# EAGLE design EnvironmentMonitorV6.1 (EAGLE 7.4.0)

## Sheet 1 of 2
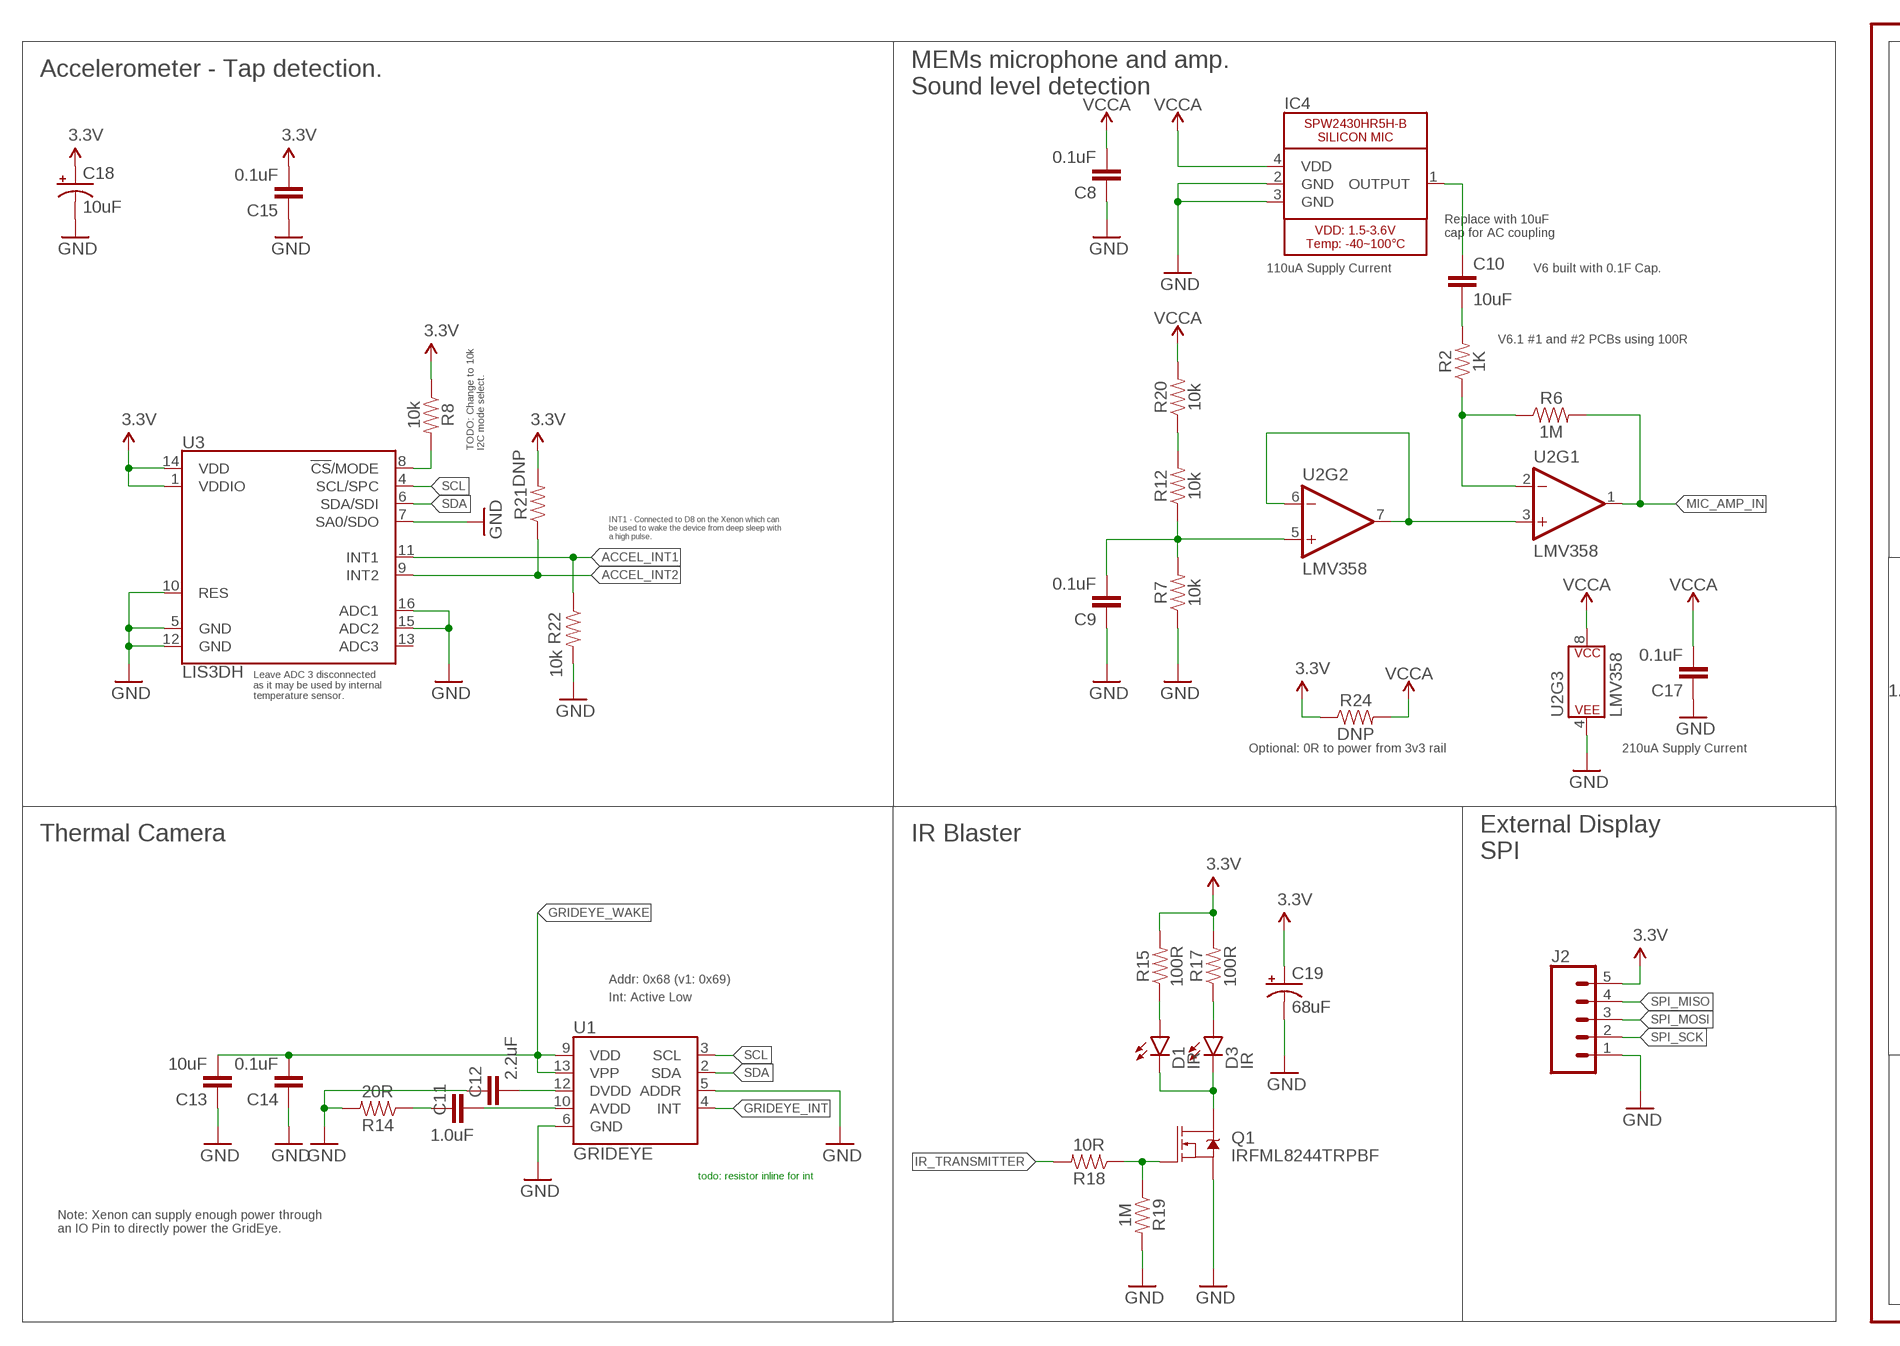
[diagram p0: schematic, sheet 1, part 1 of 2]
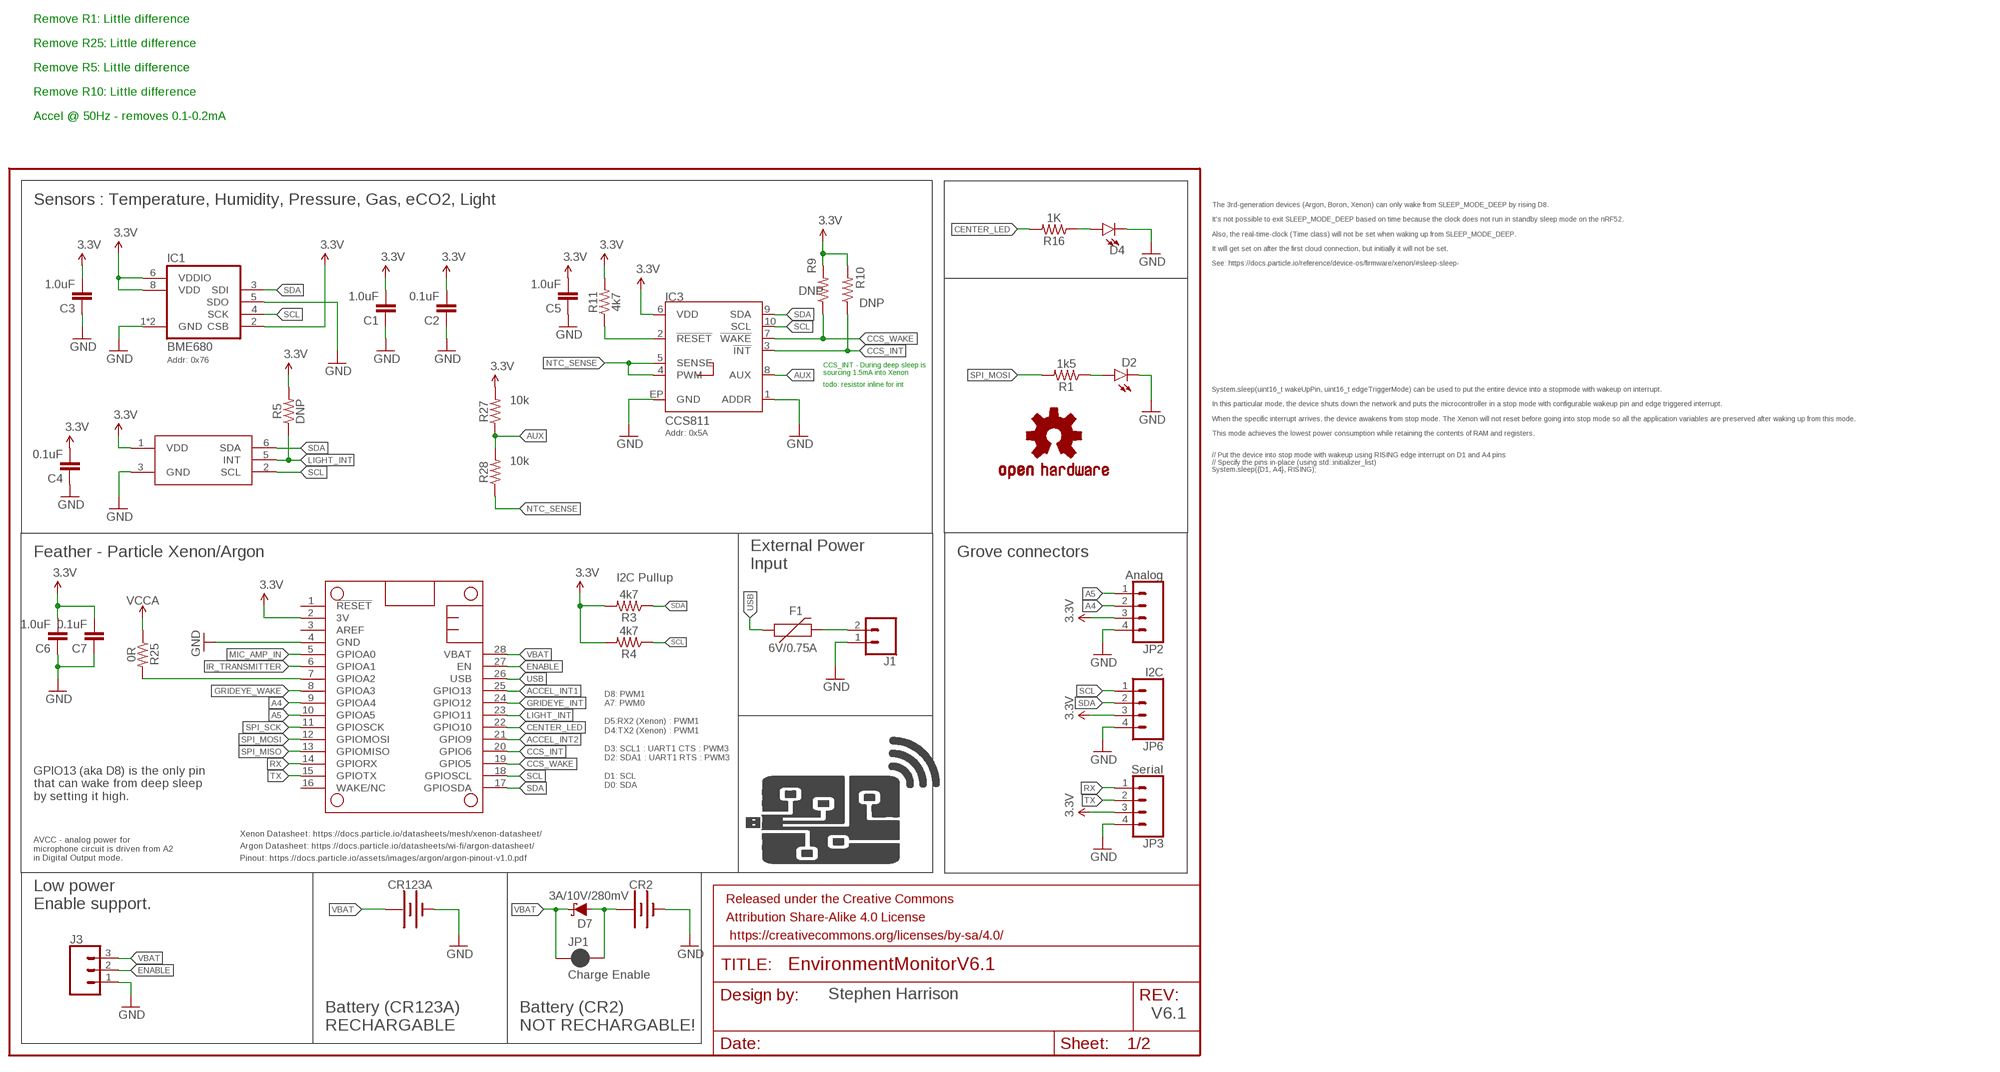
[diagram p1: schematic, sheet 1, part 2 of 2]

### Parts
C1  1.0uF  1.0UF-25V-+80/-20(0805)"  [0805-CAP]
C2  0.1uF  1.0UF-25V-+80/-20(0805)"  [0805-CAP]
C3  1.0uF  1.0UF-25V-+80/-20(0805)"  [0805-CAP]
C4  0.1uF  1.0UF-25V-+80/-20(0805)"  [0805-CAP]
C5  1.0uF  1.0UF-25V-+80/-20(0805)"  [0805-CAP]
C6  1.0uF  1.0UF-25V-+80/-20(0805)"  [0805-CAP]
C7  0.1uF  1.0UF-25V-+80/-20(0805)"  [0805-CAP]
C8  0.1uF  1.0UF-25V-+80/-20(0805)"  [0805-CAP]
C9  0.1uF  1.0UF-25V-+80/-20(0805)"  [0805-CAP]
C10  10uF  1.0UF-25V-+80/-20(0805)"  [0805-CAP]
C11  1.0uF  1.0UF-25V-+80/-20(0805)"  [0805-CAP]
C12  2.2uF  1.0UF-25V-+80/-20(0805)"  [0805-CAP]
C13  10uF  1.0UF-25V-+80/-20(0805)"  [0805-CAP]
C14  0.1uF  1.0UF-25V-+80/-20(0805)"  [0805-CAP]
C15  0.1uF  1.0UF-25V-+80/-20(0805)"  [0805-CAP]
C17  0.1uF  1.0UF-25V-+80/-20(0805)"  [0805-CAP]
C18  10uF  10UF-POLAR-EIA3216-16V-10%(TANT)  [EIA3216]
C19  68uF  68UF-POLAR-EIA3528-10V-10%(TANT)  [EIA3528]
CR2  BATTERYCR2-NO-HOLES  [BATTERY_CR2-HOLDER-NO-HOLES]
CR123A  BATTERY-16340  [BATTERY_16340-HOLDER]
D1  IR  LED1206  [LED-1206]
D2  LED1206-BOTTOM  [LED-1206-BOTTOM]
D3  IR  LED1206  [LED-1206]
D4  LED1206  [LED-1206]
D7  3A/10V/280mV  DIODE-SCHOTTKY-BAT60A  [SOD-323]
F1  6V/0.75A  PPTC_THREE-QUARTER-AMP  [1206]
FRAME1  FRAME-LETTER  [CREATIVE_COMMONS]
IC1  BME680  [BME680]
IC2  TCS3472  [FN-6]
IC3  CCS811  [LGA10]
IC4  SPW2430HR5H-B  [SPW2430HR5H-B]
IC5  FEATHERWINGPADS_AND_PLACE_ONLY  [FEATHERWIND_PADS_AND_PLACE]
J1  CONN_02JST-2-PH-SIDE  [JST-2-SMD]
J2  CONN_05SMD2  [1X05_1MM_RA]
J3  CONN_03SMD  [1X03-1MM-RA]
JP1  Charge Enable  JUMPER-SMT_2_NC_PASTE_SILK  [SMT-JUMPER_2_NC_PASTE_SILK]
JP2  Analog  CONN_04GROVE-JST-PH-4-2MM  [JST-4-PH-GROVE]
JP3  Serial  CONN_04GROVE-JST-PH-4-2MM  [JST-4-PH-GROVE]
JP6  I2C  CONN_04GROVE-JST-PH-4-2MM  [JST-4-PH-GROVE]
LOGO1  OSHW-LOGOM  [OSHW-LOGO-M]
Q1  IRFML8244TRPBF  MOSFET-NCH-BSS138  [SOT23-3]
R1  1k5  RESISTOR0805  [0805]
R2  1K  RESISTOR0805  [0805]
R3  4k7  RESISTOR0805  [0805]
R4  4k7  RESISTOR0805  [0805]
R5  DNP  RESISTOR0805  [0805]
R6  1M  RESISTOR0805  [0805]
R7  10k  RESISTOR0805  [0805]
R8  10k  RESISTOR0805  [0805]
R9  DNP  RESISTOR0805  [0805]
R10  DNP  RESISTOR0805  [0805]
R11  4k7  RESISTOR0805  [0805]
R12  10k  RESISTOR0805  [0805]
R14  20R  RESISTOR0805  [0805]
R15  100R  RESISTOR0805  [0805]
R16  1K  RESISTOR0805  [0805]
R17  100R  RESISTOR0805  [0805]
R18  10R  RESISTOR0805  [0805]
R19  1M  RESISTOR0805  [0805]
R20  10k  RESISTOR0805  [0805]
R21  DNP  RESISTOR0805  [0805]
R22  10k  RESISTOR0805  [0805]
R24  DNP  RESISTOR0805  [0805]
R25  0R  RESISTOR0805  [0805]
R27  10k  RESISTOR0805  [0805]
R28  10k  RESISTOR0805  [0805]
U1  GRIDEYE  [GRIDEYE-AMG88]
U2  LMV358  LMV358SOIC  [SO08]
U3  LIS3DH  [LGA-16-3X3]
U$1  THINGYSTICKS_LOGOLOGO_2  [THINGYSTICKS_LOGO_2]

### Nets
3.3V: C1.2 C2.2 C3.2 C4.2 C5.2 C6.2 C7.2 C15.2 C18.+ C19.A(+) IC1.2(CSB) IC1.6(VDDIO) IC1.8(VDD) IC2.1(VDD) IC3.6(VDD) IC5.2(3V) J2.5 JP2.3 JP3.3 JP6.3 R3.2 R4.2 R5.2 R8.1 R9.2 R10.2 R11.2 R15.2 R17.2 R21.2 R24.1 R27.2 U3.1(VDDIO) U3.14(VDD)
A4: IC5.9(GPIOA4) JP2.2
A5: IC5.10(GPIOA5) JP2.1
ACCEL_INT1: IC5.25(GPIO13) R22.1 U3.11(INT1)
ACCEL_INT2: IC5.21(GPIO9) R21.1 U3.9(INT2)
AUX: IC3.8(AUX) R27.1 R28.2
CCS8_RESET: IC3.2(!RESET!) R11.1
CCS_INT: IC3.3(!INT!) IC5.20(GPIO6) R10.1
CCS_WAKE: IC3.7(!WAKE!) IC5.19(GPIO5) R9.1
CENTER_LED: IC5.22(GPIO10) R16.2
ENABLE: IC5.27(EN) J3.2
GND: C1.1 C2.1 C3.1 C4.1 C5.1 C6.1 C7.1 C8.1 C9.1 C12.1 C13.1 C14.1 C15.1 C17.1 C18.- C19.C(-) CR2.P$2(-) CR123A.P$2(-) D2.C D4.C IC1.1(GND) IC1.5(SDO) IC1.7(GND) IC2.3(GND) IC3.1(ADDR) IC3.EP(GND) IC4.2(GND) IC4.3(GND) IC5.4(GND) J1.1 J2.1 J3.1 JP2.4 JP3.4 JP6.4 Q1.2(S) R7.1 R14.2 R19.2 R22.2 U1.5(ADDR) U1.6(GND) U2.4(P$V-) U3.5(GND) U3.7(SA0/SDO) U3.10(RES) U3.12(GND) U3.15(ADC2) U3.16(ADC1)
GRIDEYE_INT: IC5.24(GPIO12) U1.4(INT)
GRIDEYE_WAKE: C13.2 C14.2 IC5.8(GPIOA3) U1.9(VDD) U1.13(VPP)
IR_TRANSMITTER: IC5.6(GPIOA1) R18.2
LIGHT_INT: IC2.5(INT) IC5.23(GPIO11) R5.1
MIC_AMP_IN: IC5.5(GPIOA0) R6.2 U2.1(OUT)
N$1: R2.1 R6.1 U2.2(-IN)
N$2: D1.A R15.1
N$4: C10.2 R2.2
N$5: U2.3(+IN) U2.6(-IN) U2.7(OUT)
N$6: D2.A R1.1
N$7: C10.1 IC4.1(OUTPUT)
N$8: D3.A R17.1
N$9: C9.2 R7.2 R12.1 U2.5(+IN)
N$11: D1.C D3.C Q1.3(D)
N$12: R12.2 R20.1
N$13: IC5.7(GPIOA2) R25.2
N$14: C12.2 U1.12(DVDD)
N$15: C11.2 U1.10(AVDD)
N$16: C11.1 R14.1
N$17: CR2.P$1(+) D7.A JP1.2
N$18: Q1.1(G) R18.1 R19.1
N$19: F1.2 J1.2
N$20: D4.A R16.1
N$25: R8.2 U3.8(!CS!/MODE)
NTC_SENSE: IC3.4(PWM) IC3.5(SENSE) R28.1
RX: IC5.14(GPIORX) JP3.1
SCL: IC1.4(SCK) IC2.2(SCL) IC3.10(SCL) IC5.18(GPIOSCL) JP6.1 R4.1 U1.3(SCL) U3.4(SCL/SPC)
SDA: IC1.3(SDI) IC2.6(SDA) IC3.9(SDA) IC5.17(GPIOSDA) JP6.2 R3.1 U1.2(SDA) U3.6(SDA/SDI)
SPI_MISO: IC5.13(GPIOMISO) J2.4
SPI_MOSI: IC5.12(GPIOMOSI) J2.3 R1.2
SPI_SCK: IC5.11(GPIOSCK) J2.2
TX: IC5.15(GPIOTX) JP3.2
USB: F1.1 IC5.26(USB)
VBAT: CR123A.P$1(+) D7.C IC5.28(VBAT) J3.3 JP1.1
VCCA: C8.2 C17.2 IC4.4(VDD) R20.2 R24.2 R25.1 U2.8(P$V+)
Unconnected: IC5.1(!RESET) IC5.3(AREF) IC5.16(WAKE/NC) U3.13(ADC3)

### Notes on the sheet
- Remove R1: Little difference
- Remove R25: Little difference
- Remove R5: Little difference
- Remove R10: Little difference
- Accel @ 50Hz - removes 0.1-0.2mA
- Accelerometer - Tap detection. | Sensors : Temperature, Humidity, Pressure, Gas, eCO2, Light
- MEMs microphone and amp.
  Sound level detection
- The 3rd-generation devices (Argon, Boron, Xenon) can only wake from SLEEP_MODE_DEEP by rising D8. 
  
  It's not possible to exit SLEEP_MODE_DEEP based on time because the clock does not run in standby sleep mode on the nRF52.
  
  Also, the real-time-clock (Time class) will not be set when waking up from SLEEP_MODE_DEEP.
  
  It will get set on after the first cloud connection, but initially it will not be set.
  
  See: https://docs.particle.io/reference/device-os/firmware/xenon/#sleep-sleep-
- Replace with 10uF 
  cap for AC coupling
- 110uA Supply Current | V6 built with 0.1F Cap.
- Addr: 0x76
- CCS_INT - During deep sleep is
  sourcing 1.5mA into Xenon
- V6.1 #1 and #2 PCBs using 100R | todo: resistor inline for int
- Addr: 0x5A
- System.sleep(uint16_t wakeUpPin, uint16_t edgeTriggerMode) can be used to put the entire device into a stopmode with wakeup on interrupt. 
  
  In this particular mode, the device shuts down the network and puts the microcontroller in a stop mode with configurable wakeup pin and edge triggered interrupt. 
  
  When the specific interrupt arrives, the device awakens from stop mode. The Xenon will not reset before going into stop mode so all the application variables are preserved after waking up from this mode. 
  
  This mode achieves the lowest power consumption while retaining the contents of RAM and registers.
- TODO: Change to 10k
  I2C mode select.
- // Put the device into stop mode with wakeup using RISING edge interrupt on D1 and A4 pins
  // Specify the pins in-place (using std::initializer_list)
  System.sleep({D1, A4}, RISING);
- INT1 - Connected to D8 on the Xenon which can
  be used to wake the device from deep sleep with
  a high pulse.
- Feather - Particle Xenon/Argon | Grove connectors
- External Power 
  Input
- I2C Pullup
- Leave ADC 3 disconnected
  as it may be used by internal
  temperature sensor.
- Optional: 0R to power from 3v3 rail | 210uA Supply Current
- Thermal Camera | IR Blaster
- External Display
  SPI
- D8: PWM1
  A7: PWM0
  
  D5:RX2 (Xenon) : PWM1
  D4:TX2 (Xenon) : PWM1
  
  D3: SCL1 : UART1 CTS : PWM3
  D2: SDA1 : UART1 RTS : PWM3
  
  D1: SCL
  D0: SDA
- GPIO13 (aka D8) is the only pin
  that can wake from deep sleep 
  by setting it high.
- Addr: 0x68 (v1: 0x69)
- Int: Active Low | Xenon Datasheet: https://docs.particle.io/datasheets/mesh/xenon-datasheet/
- Argon Datasheet: https://docs.particle.io/datasheets/wi-fi/argon-datasheet/
- AVCC - analog power for 
  microphone circuit is driven from A2
  in Digital Output mode.
- Pinout: https://docs.particle.io/assets/images/argon/argon-pinout-v1.0.pdf
- Low power
  Enable support.
- todo: resistor inline for int
- Note: Xenon can supply enough power through
  an IO Pin to directly power the GridEye.
- Stephen Harrison
- V6.1
- Battery (CR123A)
  RECHARGABLE
- Battery (CR2)
  NOT RECHARGABLE!

## Sheet 2 of 2
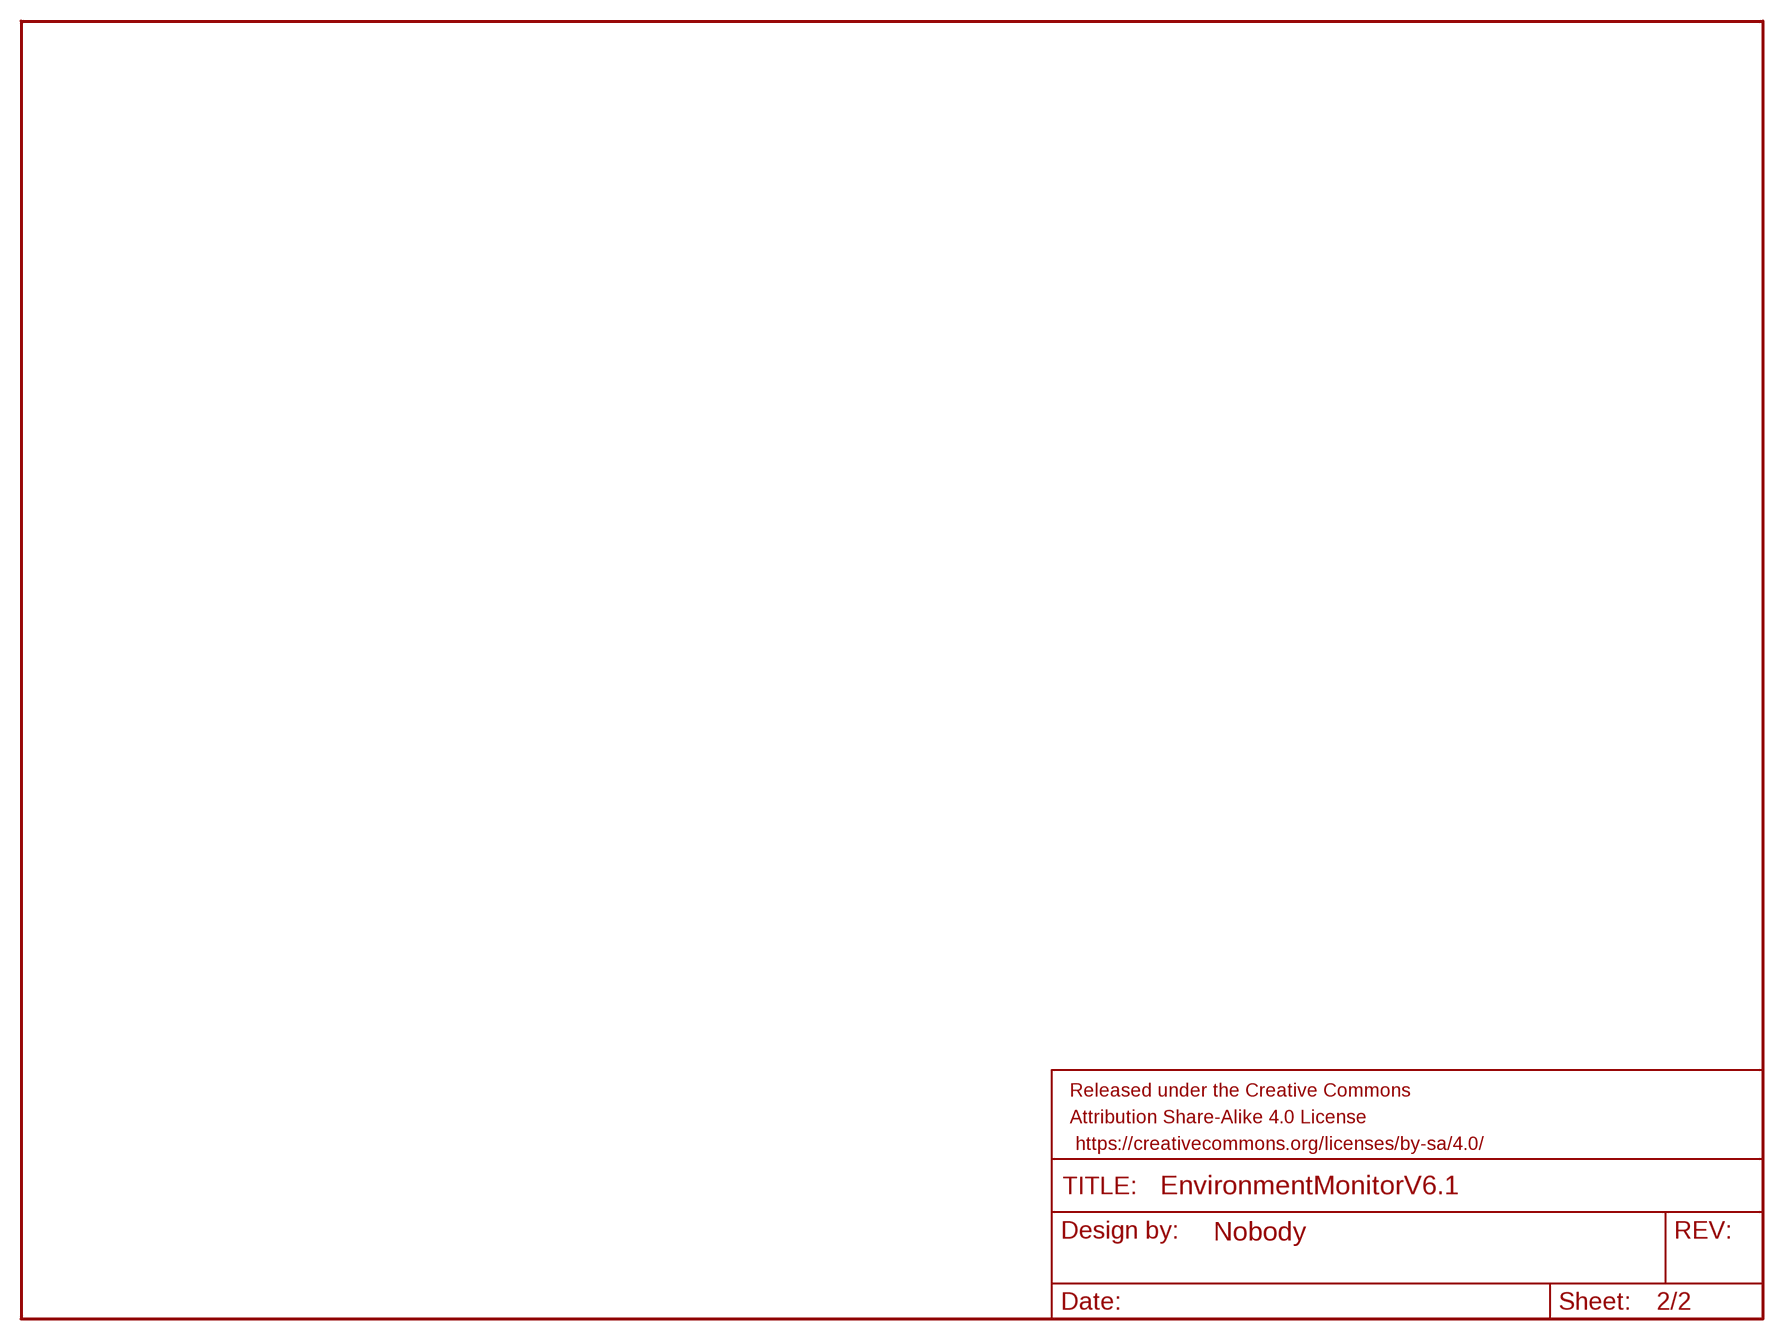
[diagram p2: schematic, sheet 2]

### Parts
FRAME2  FRAME-LETTERNO_PACKAGE  [DUMMY]

## Library data of the parts
C1 C3 C5 C6 C11 = SparkFun-Capacitors:1.0UF-25V-+80/-20(0805): CAP-11625; PROD_ID: CAP-11625
C2 C4 C7-C10 C13-C15 C17 = SparkFun-Capacitors:1.0UF-25V-+80/-20(0805): CAP-11625; PROD_ID: CAP-11625; VALUE: 1.0uF
C12 = SparkFun-Capacitors:1.0UF-25V-+80/-20(0805): CAP-11625; FARNELL: 2070473; PROD_ID: CAP-11625; VALUE: 1.0uF
C18 = SparkFun-Capacitors:10UF-POLAR: 10.0µF polarized capacitors A capacitor is a passive two-terminal electrical component used to store electrical energy temporarily in an electric field.; FARNELL: 1457413; MFG: T491A106K010AT; PROD_ID: CAP-00811
C19 = SparkFun-Capacitors:68UF-POLAR: 68µF polarized capacitors A capacitor is a passive two-terminal electrical component used to store electrical energy temporarily in an electric field.; PROD_ID: CAP-10790
CR2 CR123A = ThingySticks:BATTERY: Battery - Single Cell A variety of battery chemistries, sizes, and footprints. Device List: 20MM_PTH - Coin Cell Battery Holder - 20mm (PTH) <https://www.sparkfun.com/products/783> 12MM_SMD - Coin Cell Battery Holder - 12mm (SMD) <https://www.sparkfun.com/products/10592> 12MM_PTH - Coin Cell Battery Holder - 12mm (PTH) <https://www.sparkfun.com/products/7948> 20MM_SMD - 20mm Coin Cell Battery Holder (SMD) (2 legs) Used on the Big Time Watch Kit <https://www.sparkfun.com/products/11734> 20MM_SMD_4LEGS - Coin Cell Battery Holder - 20mm (SMD) <https://www.sparkfun.com/products/11892> 20MM_SMD_4LEGS_OVERPASTE - Coin Cell Battery Holder - 20mm (SMD) <https://www.sparkfun.com/products/11892> (Over-paste on the legs) 24.5MM_PTH - Coin Cell Battery Holder - 24.5mm (PTH) <https://www.sparkfun.com/products/8863> 9V - 9V Battery Holder - PC Mount Used on the SparkFun SparkPunk Sound Kit <https://www.sparkfun.com/products/11177> and SparkFun SparkPunk Sequencer Kit <https://www.sparkfun.com/products/12707> 18650 - Battery Holder - 18650 (PTH) <https://www.sparkfun.com/products/13113> AA - Battery Holder - 1xAA (PTH) <https://www.sparkfun.com/products/7949> AAA - Battery Holder - 1xAAA (PTH) <https://www.sparkfun.com/products/12718> AA_KIT - Battery Holder - 1xAA (PTH) <https://www.sparkfun.com/products/7949> Special kit package - pads only have exposed copper on one side of the board. AAA_KIT - Battery Holder - 1xAAA (PTH) <https://www.sparkfun.com/products/12718> Special kit package - pads only have exposed copper on one side of the board.
D1 D3 = SparkFun-LED:LED: LEDs Standard schematic elements and footprints for 5mm, 3mm, 1206, and 0603 sized LEDs. 5mm - Spark Fun Electronics SKU : COM-00529 (and others); FARNELL: 2313501
D2 = SparkFun-LED:LED: LEDs Standard schematic elements and footprints for 5mm, 3mm, 1206, and 0603 sized LEDs. 5mm - Spark Fun Electronics SKU : COM-00529 (and others)
D4 = ThingySticks:LED: LED (Generic) Standard schematic elements and footprints for 5mm, 3mm, 1206, and 0603 sized LEDs. Generic LEDs with no color specified.
D7 = SparkFun-DiscreteSemi:DIODE-SCHOTTKY: Schottky diode A Schottky diode is a semiconductor diode which has a low forward voltage drop and a very fast switching action.; PROD_ID: DIO-14072
F1 = SparkFun-Fuses:PPTC: Resettable Fuse PPTC Resettable Fuse. Really a sort of resistor with a polymeric positive temperature coefficient whose resistance increases dramatically with an increase in temperature. When heated by the power passing through the resistance rises causing the current to be limited, protecting the circuit. This is achieved by the transition of the polymer from a crystalline to an amorphous state where the conductive carbon separates breaking the conductive pathways found in the cool crystalline structure. When a PPTC cools back down it resumes conducting letting the circuit turn back on. SparkFun Products: SparkFun RedBoard - Programmed with Arduino <https://www.sparkfun.com/products/12757> Pro Micro - 5V/16MHz <https://www.sparkfun.com/products/12640> Arduino Pro 328 - 5V/16MHz <https://www.sparkfun.com/products/10915> MP3 Trigger <https://www.sparkfun.com/products/13720>; FARNELL: 2786571; PROD_ID: RES-11150
FRAME1 = SparkFun-Aesthetics:FRAME-LETTER: Schematic Frame - Letter Standard 8.5x11 US Letter frame
FRAME2 = SparkFun-Aesthetics:FRAME-LETTER: Schematic Frame - Letter Standard 8.5x11 US Letter frame; DESIGNER: Nobody; VERSION: v01
IC1 = ThingySticks:BME680: BME680 integrates for the first time individual high linearity and high accuracy sensors for gas, pressure, humidity and temperature. The library has been designed by Richard Magdycz <https://www.facebook.com/groups/eaglecadsoftUK> Original version had pins in incorrect places (BME680 uses untypical clockwise direction). Updated 17 Feb 2018 S.Harrison ThingySticks.com
IC2 = TCS3472:TCS3472
IC3 = ThingySticks:CCS811: AMS CCS811 – I2C Digital Gas Sensor Ultra-Low Power Digital Gas Sensor for Monitoring Indoor Air Quality AMS Product Page <http://ams.com/eng/Products/Environmental-Sensors/Gas-Sensors/CCS811> SparkFun Products:; PROD_ID: IC-13607
IC4 = microbuilder:SPW2430HR5H-B: SPW2430HR5H-B - Silicon Microphone
IC5 = ThingySticks:FEATHERWING
J1 = ThingySticks:CONN_02: Multi connection point. Often used as Generic Header-pin footprint for 0.1 inch spaced/style header connections On any of the 0.1 inch spaced packages, you can populate with these: Break Away Headers - Straight <https://www.sparkfun.com/products/116> (PRT-00116) Break Away Male Headers - Right Angle <https://www.sparkfun.com/products/553> (PRT-00553) Female Headers <https://www.sparkfun.com/products/115> (PRT-00115) Break Away Headers - Machine Pin <https://www.sparkfun.com/products/117> (PRT-00117) Break Away Female Headers - Swiss Machine Pin <https://www.sparkfun.com/products/743> (PRT-00743) For SCREWTERMINALS and SPRING TERMINALS visit here: Screw Terimnals on SparkFun.com <https://www.sparkfun.com/search/results?term=Screw+Terminals> (5mm/3.5mm/2.54mm spacing) This device is also useful as a general connection point to wire up your design to another part of your project. Our various solder wires solder well into these plated through hole pads. Hook-Up Wire - Assortment (Stranded, 22 AWG) <https://www.sparkfun.com/products/11375> (PRT-11375) Hook-Up Wire - Assortment (Solid Core, 22 AWG) <https://www.sparkfun.com/products/11367> (PRT-11367) View the entire wire category on our website here <https://www.sparkfun.com/categories/141> Special notes: Molex polarized connector foot print use with: PRT-08233 with associated crimp pins and housings. 2.54_SCREWTERM for use with PRT-10571. 3.5mm Screw Terminal footprints for PRT-08084 5mm Screw Terminal footprints for use with PRT-08432
J2 = SparkFun-Connectors:CONN_05: Multi connection point. Often used as Generic Header-pin footprint for 0.1 inch spaced/style header connections On any of the 0.1 inch spaced packages, you can populate with these: Break Away Headers - Straight <https://www.sparkfun.com/products/116> (PRT-00116) Break Away Male Headers - Right Angle <https://www.sparkfun.com/products/553> (PRT-00553) Female Headers <https://www.sparkfun.com/products/115> (PRT-00115) Break Away Headers - Machine Pin <https://www.sparkfun.com/products/117> (PRT-00117) Break Away Female Headers - Swiss Machine Pin <https://www.sparkfun.com/products/743> (PRT-00743) For SCREWTERMINALS and SPRING TERMINALS visit here: Screw Terimnals on SparkFun.com <https://www.sparkfun.com/search/results?term=Screw+Terminals> (5mm/3.5mm/2.54mm spacing) This device is also useful as a general connection point to wire up your design to another part of your project. Our various solder wires solder well into these plated through hole pads. Hook-Up Wire - Assortment (Stranded, 22 AWG) <https://www.sparkfun.com/products/11375> (PRT-11375) Hook-Up Wire - Assortment (Solid Core, 22 AWG) <https://www.sparkfun.com/products/11367> (PRT-11367) View the entire wire category on our website here <https://www.sparkfun.com/categories/141> Special notes: Molex polarized connector foot print use with SKU : PRT-08231 with associated crimp pins and housings. 1MM SMD Version SKU: PRT-10208
J3 = SparkFun-Connectors:CONN_03: Multi connection point. Often used as Generic Header-pin footprint for 0.1 inch spaced/style header connections On any of the 0.1 inch spaced packages, you can populate with these: Break Away Headers - Straight <https://www.sparkfun.com/products/116> (PRT-00116) Break Away Male Headers - Right Angle <https://www.sparkfun.com/products/553> (PRT-00553) Female Headers <https://www.sparkfun.com/products/115> (PRT-00115) Break Away Headers - Machine Pin <https://www.sparkfun.com/products/117> (PRT-00117) Break Away Female Headers - Swiss Machine Pin <https://www.sparkfun.com/products/743> (PRT-00743) Stackable Header - 3 Pin (Female, 0.1") <https://www.sparkfun.com/products/13875> (PRT-13875) For SCREWTERMINALS and SPRING TERMINALS visit here: Screw Terimnals on SparkFun.com <https://www.sparkfun.com/search/results?term=Screw+Terminals> (5mm/3.5mm/2.54mm spacing) This device is also useful as a general connection point to wire up your design to another part of your project. Our various solder wires solder well into these plated through hole pads. Hook-Up Wire - Assortment (Stranded, 22 AWG) <https://www.sparkfun.com/products/11375> (PRT-11375) Hook-Up Wire - Assortment (Solid Core, 22 AWG) <https://www.sparkfun.com/products/11367> (PRT-11367) View the entire wire category on our website here <https://www.sparkfun.com/categories/141> Special notes: Molex polarized connector foot print use with SKU : PRT-08232 with associated crimp pins and housings.
JP1 = SparkFun-Jumpers:JUMPER-SMT_2_NC_PASTE: Normally closed solder jumper This jumper has an aperture in the stencil to allow solder paste to bridge the split in the wire so it's normally closed (NC). Wick off the solder to open the connection. Reapply solder to reclose the connection.
JP2 JP3 JP6 = ThingySticks:CONN_04: Multi connection point. Often used as Generic Header-pin footprint for 0.1 inch spaced/style header connections On any of the 0.1 inch spaced packages, you can populate with these: Break Away Headers - Straight <https://www.sparkfun.com/products/116> (PRT-00116) Break Away Male Headers - Right Angle <https://www.sparkfun.com/products/553> (PRT-00553) Female Headers <https://www.sparkfun.com/products/115> (PRT-00115) Break Away Headers - Machine Pin <https://www.sparkfun.com/products/117> (PRT-00117) Break Away Female Headers - Swiss Machine Pin <https://www.sparkfun.com/products/743> (PRT-00743) For SCREWTERMINALS and SPRING TERMINALS visit here: Screw Terimnals on SparkFun.com <https://www.sparkfun.com/search/results?term=Screw+Terminals> (5mm/3.5mm/2.54mm spacing) This device is also useful as a general connection point to wire up your design to another part of your project. Our various solder wires solder well into these plated through hole pads. Hook-Up Wire - Assortment (Stranded, 22 AWG) <https://www.sparkfun.com/products/11375> (PRT-11375) Hook-Up Wire - Assortment (Solid Core, 22 AWG) <https://www.sparkfun.com/products/11367> (PRT-11367) View the entire wire category on our website here <https://www.sparkfun.com/categories/141> Special notes: Molex polarized connector foot print use with SKU : PRT-08231 with associated crimp pins and housings. 1MM SMD Version SKU: PRT-10208
LOGO1 = SparkFun-Aesthetics:OSHW-LOGO: Open Source Hardware Logo This logo indicates the piece of hardware it is found on incorporates a OSHW license and/or adheres to the definition of open source hardware found here: http://freedomdefined.org/OSHW
Q1 = SparkFun-DiscreteSemi:MOSFET-NCH: N-channel MOSFETs Voltage controlled devices that allow control of high current outputs. SparkFun Products: SparkFun OpenScale <https://www.sparkfun.com/products/13261> SparkFun Digital Sandbox <https://www.sparkfun.com/products/12651> SparkFun Monster Moto Shield <https://www.sparkfun.com/products/10182> SparkFun MOSFET Power Controller <https://www.sparkfun.com/products/11214>; FARNELL: 1857298; PROD_ID: TRANS-00830; VALUE: 220mA/50V/3.5Ω
R1-R12 R15-R18 R20-R22 R24 R25 R27 R28 = SparkFun-Resistors:RESISTOR: Generic Resistor Package
R14 = SparkFun-Resistors:RESISTOR: Generic Resistor Package; FARNELL: 2447604
R19 = SparkFun-Resistors:RESISTOR: Generic Resistor Package; FARNELL: 2129354
U1 = SparkFun-Sensors:GRIDEYE: Panasonic AMG8833 GRIDEye This 8x8 thermopile infrared sensor array allows for a low resolution thermal camera.; PROD_ID: IC-13912
U2 = SparkFun-IC-Amplifiers:LMV358: IC LMV358 DUAL OP AMP Jellybean rail-to-rail output op-amp SparkFun Products SparkFun PicoBoard <https://www.sparkfun.com/products/11888> (WIG-11888) SparkFun Vernier Interface Shield <https://www.sparkfun.com/products/12858> (DEV-12858) SparkFun Blynk Board - ESP8266 <https://www.sparkfun.com/products/13794> (WRL-13794) SparkFun Digital Sandbox <https://www.sparkfun.com/products/12651> (DEV-12651 RoHS); PROD_ID: IC-09657
U3 = SparkFun-Sensors:LIS3DH: ST Microelectronics LIS3DH 3-Axis ±2/4/8/16g SPI/I2C Accelerometer The LIS3DH is a three axis MEMS linear accelerometer in the "nano" family. It has a digital I2C/SPI serial interface which makes it ideal for using in embedded applications. The device also features ultra low-power operational modes that allow advanced power saving and smart sleep to wake-up functions, built in detections with interrupts, and auxiliary ADC inputs Datasheet-XXXX <http://www.sparkfun.com/datasheets/Sensors/Accelerometer/LIS3DH.pdf> SparkFun Products SparkFun Triple Axis Accelerometer Breakout - LIS3DH <https://www.sparkfun.com/products/10345> (SEN-XXXXX) Triple Axis Accelerometer - LIS3DH <https://www.sparkfun.com/products/9755> (SEN-XXXXX); PROD_ID: IC-13419; SF_ID: N/A
U$1 = ThingySticks:THINGYSTICKS_LOGO

## Board
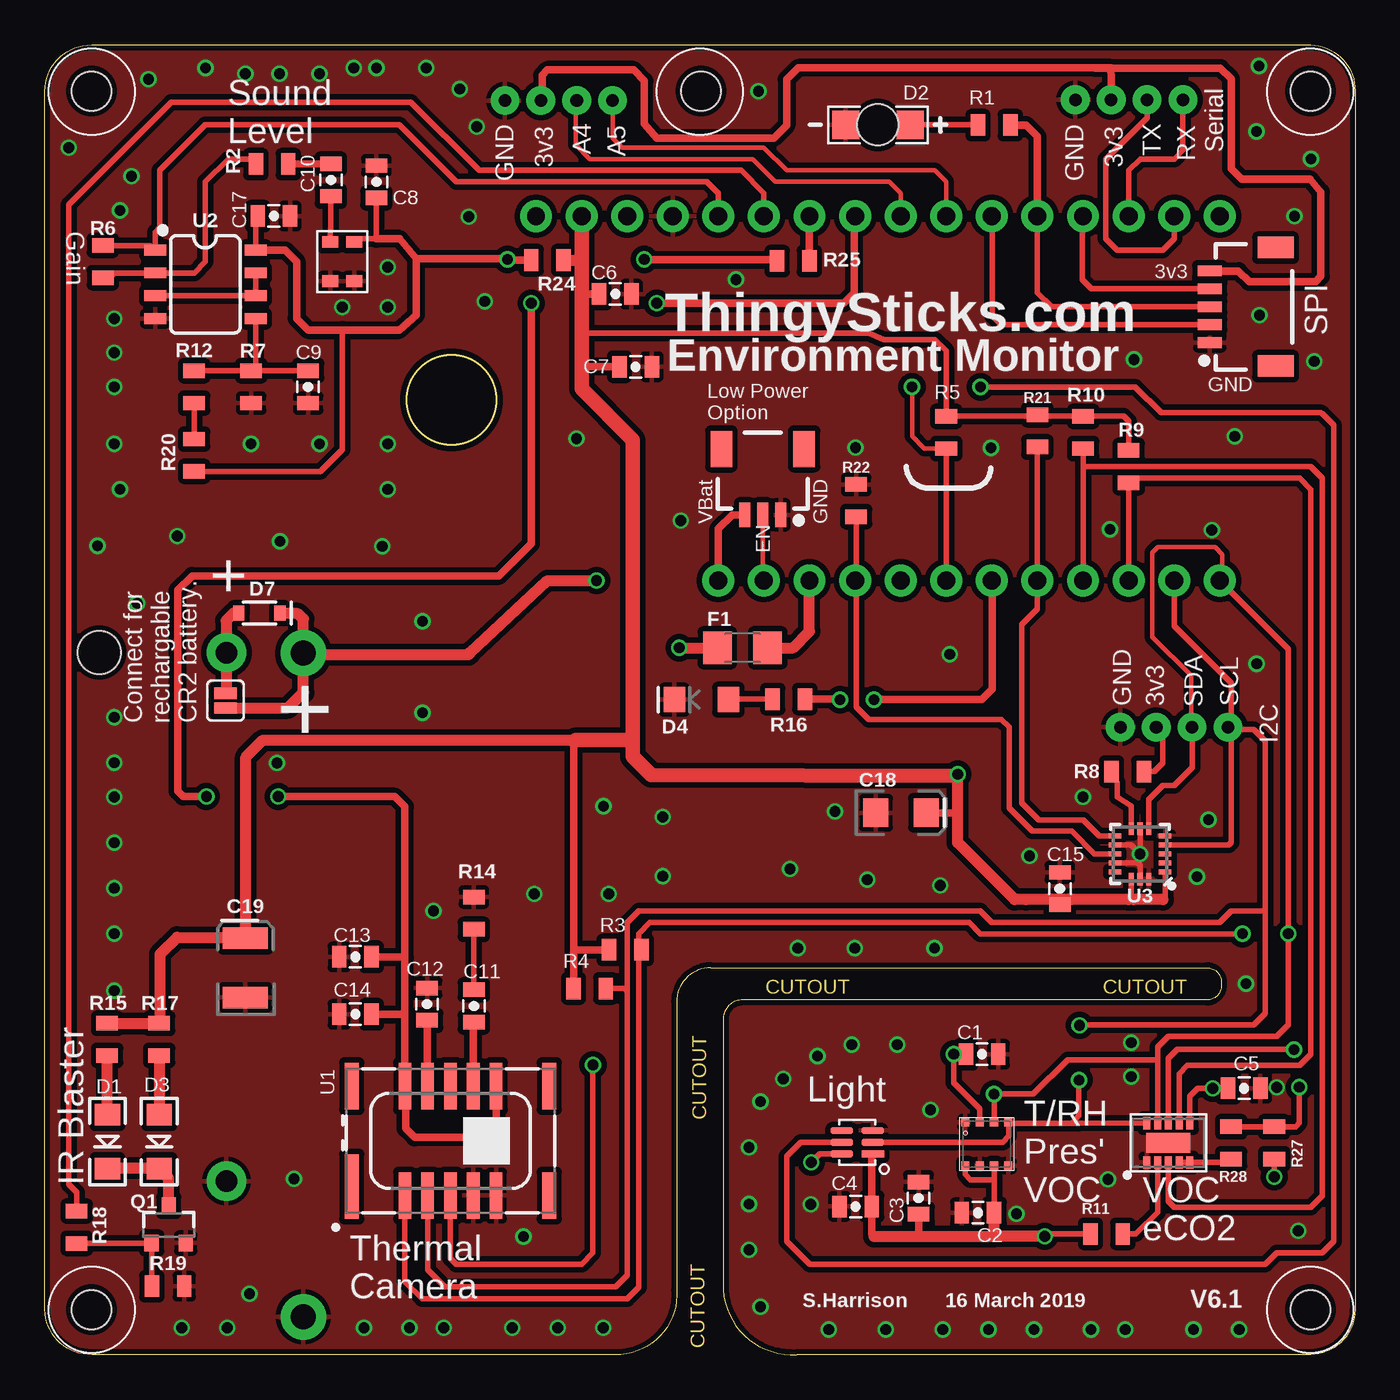
[diagram p3: board, top side]
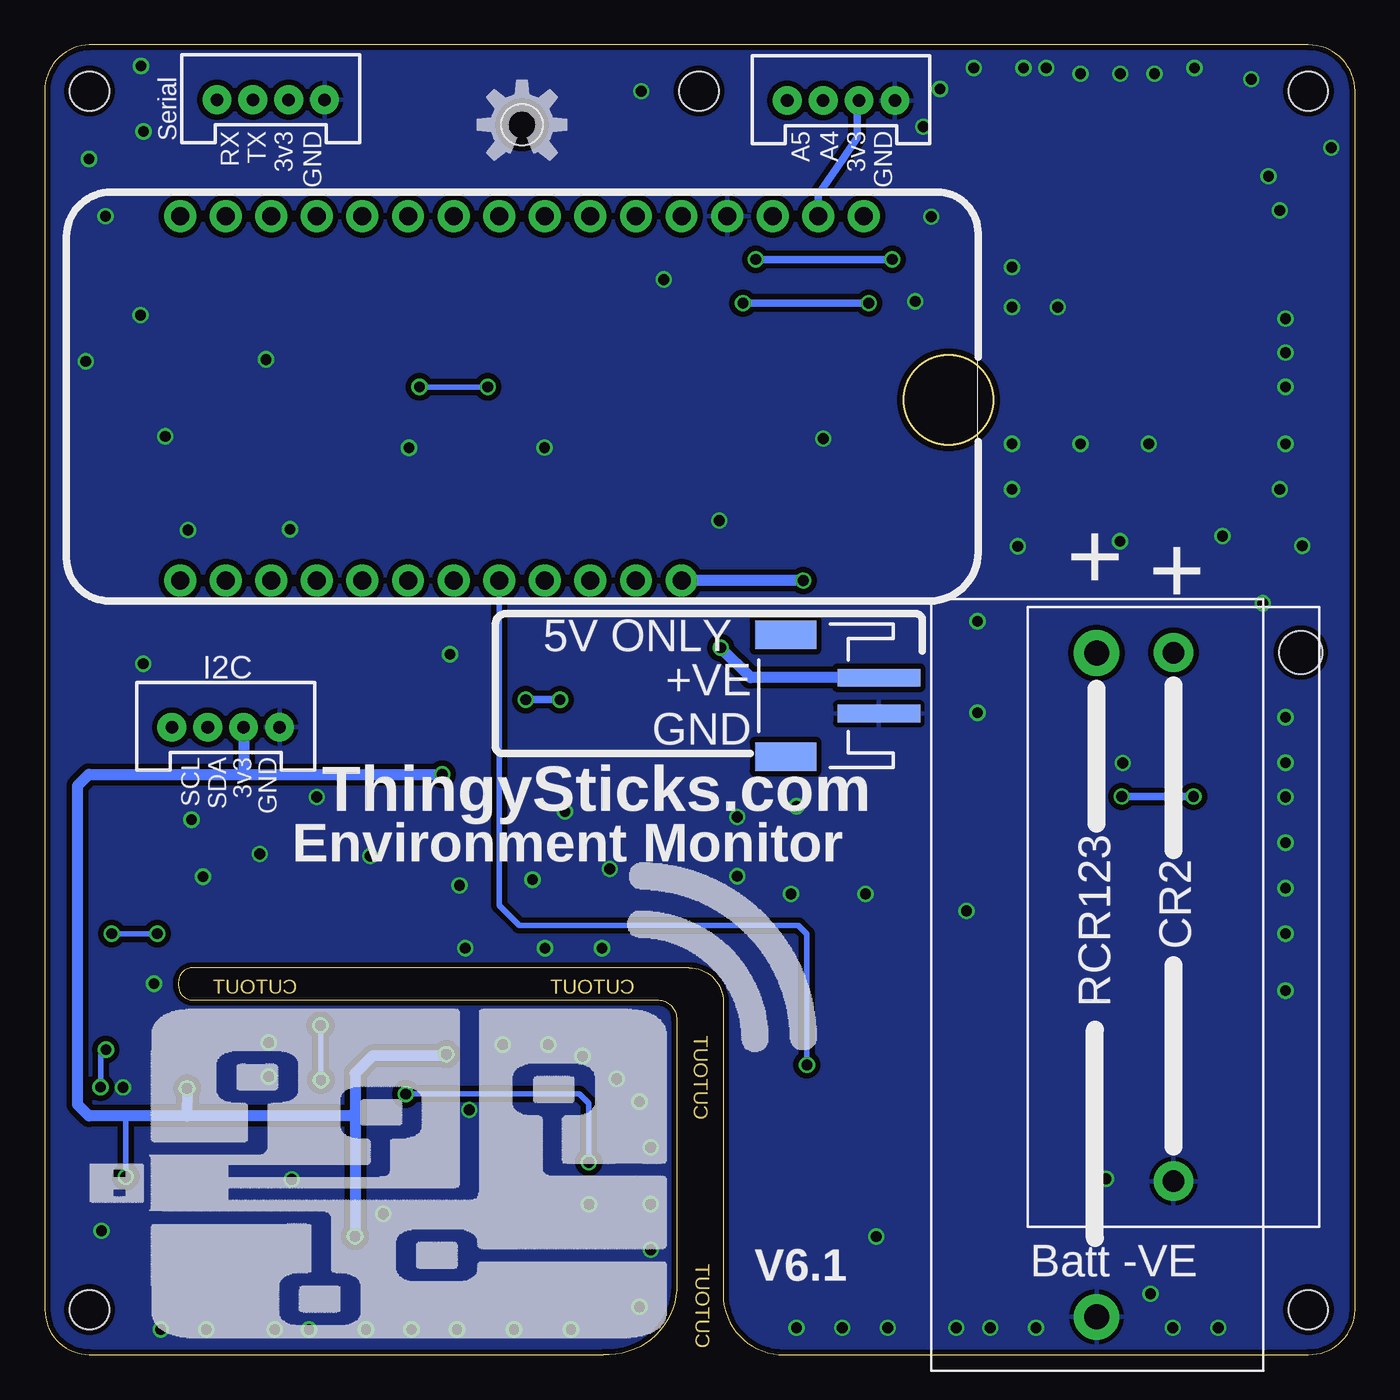
[diagram p4: board, bottom side, seen from below]

Size 73 x 73.01 mm. Coordinates in mm from the lower left corner, seen from the top.
Outline: 0,2.51 0,70.43 arc-90 2.6,73.01 70.52,73.01 arc-90 73,70.43 73,2.51 arc-90 70.52,0.01 41.9,0.01 arc-90 37.8,3.61 37.8,18.67 arc-90 38.8,19.77 64.75,19.77 arc90 65.55,20.57 65.55,20.77 arc90 64.75,21.57 37.1,21.57 arc90 35.2,19.67 35.2,3.61 arc-90 32.1,0.01 2.6,0.01 arc-90 0,2.51
Outline: circle at 22.65,53.21 radius 2.5
Copper layers (1*16): Top 0.035mm / dielectric 1.5mm / Bottom 0.035mm
Design rules "dirt_cheap_dirty_boards.v1.1": minimum track width 6mil, minimum drill 12mil, track to track 6mil, track to pad 6mil, pad to pad 6mil, via to via 6mil, smd to smd 0mil, copper to edge 10mil, drill to drill 10mil, minimum pad ring 10mil, minimum via ring 6mil, stop-mask expansion 2mil, vias tented up to drill 25mil, thermal gap 10mil
Holes 2.2 mm at 2.6,2.51 70.52,2.51 70.52,70.43 36.56,70.43 2.6,70.43
bKeepout: area 20.4,41.9 to 71.8,64.7; area 0.1,44.4 to 20.4,62.2

### Footprints (pad centres in the part's own frame; a part is rotated, then mirrored left to right if it is on the bottom)
0805-CAP = smd 0.8 x 1.2: 1 -0.9,0; 2 0.9,0
EIA3216 = smd 1.4 x 1.6: + 1.4,0; - -1.4,0
EIA3528 = smd 1.2 x 2.5: A 1.65,0; C -1.65,0
BATTERY_CR2-HOLDER-NO-HOLES = drill 1.2 pad 2.184: P$1 2.54,8.13; P$2 32,8.13 | hole 2.4: 2.54,15.22
BATTERY_16340-HOLDER = drill 1.4 pad 2.54: P$1 3,9.2; P$2 40,9.2
LED-1206 = smd 1.2 x 1.4: A -1.5,0; C 1.5,0
LED-1206-BOTTOM = smd 1.5 x 1.6: A -1.8,0; C 1.8,0 | hole 2.3: 0,0
SOD-323 = smd 0.63 x 0.83: A 1.15,0; C -1.15,0
1206 = smd 1.6 x 1.8: 1 -1.4,0; 2 1.4,0
BME680 = smd 0.45 x 0.45: 1 1.2,-1.2; 2 0.4,-1.2; 3 -0.4,-1.2; 4 -1.2,-1.2; 5 -1.2,1.2; 6 -0.4,1.2; 7 0.4,1.2; 8 1.2,1.2
FN-6 = smd 1.25 x 0.4: 1 -0.875,0.65; 2 -0.875,0; 3 -0.875,-0.65; 4 0.875,-0.65; 5 0.875,0; 6 0.875,0.65
LGA10 = smd 0.7 x 0.4: 1 -1.1,1.2; 2 -1.1,0.6; 3 -1.1,0; 4 -1.1,-0.6; 5 -1.1,-1.2; 6 1.1,-1.2; 7 1.1,-0.6; 8 1.1,0; 9 1.1,0.6; 10 1.1,1.2 | smd 1.1 x 2.45: EP 0,0
SPW2430HR5H-B = smd 0.9 x 0.66: 1 -0.675,1.095; 2 -0.675,-1.095; 3 0.675,-1.095; 4 0.675,1.095
FEATHERWIND_PADS_AND_PLACE = drill 1 pad 1.778: 1 6.35,1.27; 2 8.89,1.27; 3 11.43,1.27; 4 13.97,1.27; 5 16.51,1.27; 6 19.05,1.27; 7 21.59,1.27; 8 24.13,1.27; 9 26.67,1.27; 10 29.21,1.27; 11 31.75,1.27; 12 34.29,1.27; 13 36.83,1.27; 14 39.37,1.27; 15 41.91,1.27; 16 44.45,1.27; 17 44.45,21.59; 18 41.91,21.59; 19 39.37,21.59; 20 36.83,21.59; 21 34.29,21.59; 22 31.75,21.59; 23 29.21,21.59; 24 26.67,21.59; 25 24.13,21.59; 26 21.59,21.59; 27 19.05,21.59; 28 16.51,21.59
JST-2-SMD = smd 1 x 4.6: 1 -1,-3.7; 2 1,-3.7 | smd 1.6 x 3.4: NC1 -3.4,1.5; NC2 3.4,1.5
1X05_1MM_RA = smd 0.6 x 1.35: 1 -2,0; 2 -1,0; 3 0,0; 4 1,0; 5 2,0 | smd 1.2 x 2: NC1 3.3,-3.675; NC2 -3.3,-3.675
1X03-1MM-RA = smd 0.6 x 1.35: 1 -1,0; 2 0,0; 3 1,0 | smd 1.2 x 2: NC1 2.3,-3.675; NC2 -2.3,-3.675
SMT-JUMPER_2_NC_PASTE_SILK = smd 0.635 x 1.27: 1 -0.406,0; 2 0.406,0
JST-4-PH-GROVE = drill 0.7 pad 1.6: 1 -3,-0.55; 2 -1,-0.55; 3 1,-0.55; 4 3,-0.55
SOT23-3 = smd 0.8 x 0.9: 1 -0.95,-1; 2 0.95,-1; 3 0,1.1
0805 = smd 0.8 x 1.2: 1 -0.9,0; 2 0.9,0
GRIDEYE-AMG88 = smd 0.8 x 3.6: 1 -5.5,-2.55 | smd 0.7 x 2.6: 2 -2.54,-3.05; 3 -1.27,-3.05; 4 0,-3.05; 5 1.27,-3.05; 6 2.54,-3.05; 9 2.54,3.05; 10 1.27,3.05; 11 0,3.05; 12 -1.27,3.05; 13 -2.54,3.05 | smd 0.8 x 2.6: 7 5.5,-3.05; 8 5.5,3.05; 14 -5.5,3.05
SO08 = smd 0.6 x 1.2: 1 -1.905,-2.8; 2 -0.635,-2.8; 3 0.635,-2.8; 4 1.905,-2.8; 5 1.905,2.8; 6 0.635,2.8; 7 -0.635,2.8; 8 -1.905,2.8
LGA-16-3X3 = smd 0.7 x 0.28: 1 -1.4,1; 2 -1.4,0.5; 3 -1.4,0; 4 -1.4,-0.5; 5 -1.4,-1; 9 1.4,-1; 10 1.4,-0.5; 11 1.4,0; 12 1.4,0.5; 13 1.4,1 | smd 0.28 x 0.7: 6 -0.5,-1.4; 7 0,-1.4; 8 0.5,-1.4; 14 0.5,1.4; 15 0,1.4; 16 -0.5,1.4

### Placement (x,y rotation side)
C1  52.22,16.75 180 top
C2  51.99,7.91 0 top
C3  48.68,8.73 270 top
C4  45.18,8.26 0 top
C5  66.83,14.84 180 top
C6  31.79,59.12 180 top
C7  32.92,55.07 180 top
C8  18.48,65.37 270 top
C9  14.66,53.94 90 top
C10  15.94,65.47 90 top
C11  23.9,19.44 270 top
C12  21.3,19.54 270 top
C13  17.3,22.17 0 top
C14  17.3,18.97 0 top
C15  56.55,25.98 270 top
C17  12.76,63.47 180 top
C18  47.7,30.21 0 top
C19  11.17,21.56 90 top
CR2  18.25,41.67 270 bottom
CR123A  23.6,42.11 270 bottom
D1  3.49,11.88 270 top
D2  46.41,68.55 180 top
D3  6.37,11.87 270 top
D4  36.58,36.51 180 top
D7  11.95,41.34 180 top
F1  38.87,39.4 180 top
FRAME1  4.13,-9.28 0 top  (outside the outline)
FRAME2  -24.9,-36.69 0 top  (outside the outline)
IC1  52.48,11.74 180 top
IC2  45.27,11.84 180 top
IC3  62.6,11.81 90 top
IC4  16.57,60.93 0 top
IC5  21.02,64.74 180 bottom
J1  30.23,36.73 90 bottom
J2  64.9,58.41 90 top
J3  40,46.81 180 top
JP1  10.06,36.45 90 top
JP2  28.64,70.45 0 bottom
JP3  60.41,70.5 0 bottom
JP6  62.93,35.53 0 bottom
LOGO1  46.41,68.55 0 bottom
Q1  6.9,7.22 0 top
R1  52.9,68.54 0 top
R2  12.66,66.36 0 top
R3  32.34,22.57 180 top
R4  30.36,20.41 180 top
R5  50.23,51.4 90 top
R6  3.24,60.93 90 top
R7  11.49,53.94 90 top
R8  60.33,32.5 180 top
R9  60.38,49.5 90 top
R10  57.84,51.4 90 top
R11  59.16,6.73 180 top
R12  8.31,53.94 270 top
R14  23.9,24.61 90 top
R15  3.47,17.57 90 top
R16  41.45,36.54 0 top
R17  6.37,17.57 90 top
R18  1.77,7.1 90 top
R19  6.86,3.82 0 top
R20  8.31,50.13 270 top
R21  55.3,51.49 90 top
R22  45.2,47.61 90 top
R24  28,61.01 180 top
R25  41.7,60.95 0 top
R27  68.5,11.81 270 top
R28  66.1,11.81 90 top
U1  22.6,11.92 0 top
U2  8.95,59.66 270 top
U3  61.02,27.91 180 top
U$1  71.55,0.12 0 bottom

### Tracks (layer width: path | path; a pad name or v marks a point on that pad's centre or on a via)
3.3V  (via drill 0.6)
  Top 0.254: R21.2 55.4,52.3
  Top 0.305: 52.03,12.99 IC1.2 52.09,13.71 50.63,15.16 50.63,16.7 C1.2 | C2.2 52.89,9.75 | 52.89,9.75 IC1.6 | IC1.8 51.29,10.04 51.58,9.75 52.89,9.75 | IC3.6 63.8,14.04 63.8,14.41 64.24,14.84 v65.08,14.84 C5.2 | U3.14 60.52,25.5 | 60.52,25.5 60.38,25.37 60.66,25.37 60.52,25.5 | U3.1 62.42,25.5 62.29,25.37 | R8.1 61.81,32.5 62.29,32.99 62.29,34.61 JP6.3 | C15.2 57.75,25.33 56.58,25.37 | 54.71,25.33 54.67,25.37 | 55.9,6.57 v55.72,6.6 55.84,6.73 R11.2 | R9.2 60.38,52.04 60.12,52.3 R10.2 55.4,52.3 R5.2 50.23,55.95 49.59,56.59 46.75,56.59 45.91,56.95 29.91,56.95 | 58.52,71.71 58.5,71.72 | R27.2 v68.5,9.91
  Top 0.406: IC2.1 46.08,11.13 C4.2 46.08,6.7 46.19,6.59 | C3.2 48.68,6.64 49.37,6.59 | C7.2 29.92,55.07 29.91,56.08 | C6.2 30.01,59.12 29.91,59.02 | JP3.3 59.41,71.1 59.4,71.72 58.5,71.72 41.97,71.72 41.34,71.09 41.34,68.54 40.6,67.81 34.1,67.81 33.4,68.61 33.4,71.01 32.8,71.61 28,71.61 27.7,71.31 27.7,69.97 JP2.3 | R4.2 29.46,22.51 | 29.46,22.51 29.46,34.12 29.59,34.26 | R3.2 29.52,22.57 29.46,22.51 | C18.+ 50.86,30.21 | J2.5 66.5,60.41 67.1,59.81 70.8,59.81 71.1,60.11 71.1,64.81 70.5,65.51 66.7,65.51 66.1,66.11 66.1,71.11 65.5,71.71 58.52,71.71
  Top 0.61: 46.19,6.59 49.37,6.59 52.86,6.59 | C1.2 v50.63,16.75 | v55.72,6.6 55.72,6.59 52.86,6.59 | C2.2 52.86,7.91 52.86,6.59 | R15.2 R17.2 6.41,18.51 6.41,22.31 7.37,23.27 11.11,23.27 C19.A 11.2,23.23 11.2,33.3 12.15,34.26 29.32,34.26 29.46,34.12 | 60.38,25.37 56.58,25.37 54.67,25.37 54.04,25.37 50.86,28.54 50.86,30.21 50.86,32.32 | 62.29,25.37 60.66,25.37 | R24.1 29.8,61.01 29.91,61.31
  Top 0.813: IC5.2 29.91,61.31 29.91,59.02 29.91,56.95 29.91,56.08 29.91,53.85 32.76,50.99 32.76,34.26 | 61.88,35.02 JP6.3 | v50.86,32.35 50.86,32.32 50.83,32.26 33.8,32.31 32.76,33.34 32.76,34.26 | 32.76,34.26 29.59,34.26
  Bottom 0.305: v68.5,9.91 68.5,13.2 68.6,13.3
  Bottom 0.406: JP2.3 27.75,69.79 27.75,67.83 28.53,66.64 29.91,64.64 IC5.2
  Bottom 0.61: v50.63,16.75 50.76,16.68 54.72,16.68 55.72,15.69 55.72,13.53 | 55.72,13.53 55.72,13.3 | 55.72,13.3 v55.72,6.6 | v65.08,14.84 65.08,14.82 65.08,13.3 | 55.94,13.3 55.72,13.3 | 55.72,13.53 55.94,13.3 | 55.94,13.3 65.08,13.3 | 65.08,13.3 68.6,13.3 70.54,13.3 71.18,13.94 71.18,31.72 70.54,32.35 61.97,32.35 | 61.97,32.35 v50.86,32.35 | JP6.3 61.93,32.4 61.97,32.35
A4
  Top 0.254: IC5.9 47.69,64.74 47.05,65.37 40.7,65.37 39.43,66.64 30.36,66.64 29.58,67.43 29.58,69.84 JP2.2
A5
  Top 0.254: JP2.1 31.64,67.81 32.17,67.28 40.07,67.28 41.34,66.01 49.59,66.01 50.23,65.37 IC5.10
ACCEL_INT1
  Top 0.254: 45.2,43.2 IC5.25
  Top 0.305: U3.11 58.48,27.91 57.21,29.18 55.03,29.18 53.73,30.47 53.73,34.98 53.3,35.41 45.9,35.41 45.2,36.11 45.2,43.09 IC5.25 | R22.1 45.2,43.2
ACCEL_INT2
  Top 0.305: U3.9 58.75,28.91 57.84,29.81 55.38,29.81 54.44,30.75 54.44,40.7 55.3,41.56 IC5.21 R21.1
AUX  (via drill 0.6)
  Top 0.305: R28.2 R27.1 69.7,12.71 69.9,12.91 v69.9,14.91 | IC3.8 62.6,16.51 63.1,17.01 v69.6,17.01
  Bottom 0.305: v69.6,17.01 69.9,16.71 v69.9,14.91
CCS8_RESET
  Top 0.305: R11.1 60.8,6.73 62,7.93 IC3.2
CCS_INT
  Top 0.305: IC3.3 62.6,8.55 62.93,8.22 70.54,8.22 71.18,8.86 71.18,48.86 70.54,49.5 57.84,49.5 | R10.1 57.84,49.5 | 57.84,49.5 IC5.20
CCS_WAKE
  Top 0.305: IC3.7 63.2,15.66 63.66,16.11 69.91,16.11 70.54,16.75 70.54,48.23 69.91,48.86 60.65,48.86 R9.1 IC5.19
CENTER_LED  (via drill 0.6)
  Top 0.406: R16.2 44.17,36.54 v44.3,36.51 | v46.2,36.51 52.2,36.51 52.8,37.11 52.8,43.11 IC5.22
  Bottom 0.406: v44.3,36.51 v46.2,36.51
ENABLE
  Top 0.254: J3.2 40,43.21 IC5.27
GND  (via drill 0.6)
  Top 0.305: U3.15 61.02,27.27 60.88,27.41 U3.12 | U3.10 60.52,28.41 v61.02,27.91 U3.7
  other vias: 42.68,8.38 59.35,46 60.68,55.47 49.35,13.65 65.02,45.97 54.14,7.85 60.53,15.49 35.43,46.49 59.24,9.77 64.83,29.81 21.65,24.73 57.84,31.08 64.19,26.64 24.06,68.45 3.87,50.77 16.57,58.39 8.95,71.72 67.52,38.51 66.3,51.18 27.28,25.68 26.67,6.58 54.87,27.79 38.51,59.93 67.67,57.94 11.49,50.77 15.3,50.77 3.87,53.94 3.87,55.85 3.87,57.75 1.33,67.28 5.78,71.09 67.65,71.82 17.21,71.72 50.42,39.04 18.48,71.72 23.12,70.55 21.25,71.72 39.77,70.42 24.51,58.7 19.11,50.77 18.79,45.05 13.09,45.33 7.38,45.63 4.19,48.23 2.94,45.08 5.14,41.88 70.54,66.64 67.5,68.18 60.53,17.4 17.78,1.5 20.32,1.5 22.23,1.5 26.04,1.5 28.58,1.5 31.12,1.5 13.88,9.8 11.4,3.4 10.16,1.5 7.62,1.5 41.96,22.66 47.49,17.28 44.95,17.28 43.05,16.64 41.14,15.37 39.87,14.1 39.24,8.39 39.24,5.85 39.87,2.67 39.24,11.56 66.54,1.4 64,1.4 60.19,1.4 58.29,1.4 55.11,1.4 52.57,1.4 50.03,1.4 46.86,1.4 43.68,1.4 3.87,35.53 3.87,32.99 3.87,31.08 3.87,28.54 3.87,20.29 3.87,23.46 3.87,26 45.13,22.66 49.58,22.66 49.89,26.15 41.52,27.07 45.16,50.56 19.11,48.23 4.19,63.78 4.82,65.69 19.11,58.39 19.11,60.61 15.3,71.4 13.08,71.4 11.17,71.4 70.72,55.36 52.71,50.55 29.62,51.05 12.94,32.98 21.04,40.88 21.04,35.78 69.84,6.9 68.64,14.9 69.62,63.46 23.61,63.43 44.02,30.27 45.82,26.47 34.42,26.67 31.12,30.57 34.42,29.97 31.42,25.67 66.92,20.67
  pour Bottom (isolate 0.305, rank 6): 72.81,72.99 72.91,-0.23 -0.13,0.17 0.06,72.89
  pour Top (isolate 0.305, rank 6): 0.06,72.89 72.81,72.96 72.91,-0.16 -0.13,0.17
GRIDEYE_INT  (via drill 0.6)
  Top 0.305: U1.4 22.6,5.37 22.92,5.05 29.91,5.05 30.54,5.68 v30.54,16.16
  Bottom 0.305: IC5.24 47.69,25.05 46.55,23.92 31.02,23.92 30.98,23.91 30.54,23.46 v30.54,16.16
GRIDEYE_WAKE  (via drill 0.6)
  Top 0.305: 19.83,18.97 20.06,19.21 | 20,22.17 20.06,22.11
  Top 0.406: U1.9 25.14,12.55 24.7,12.11 20.6,12.11 20.1,12.61 20.1,14.93 | U1.13 20.06,19.21 20.06,22.11 20.06,30.55 19.5,31.11 v13,31.11 | v9,31.11 7.7,31.11 7.4,31.41 7.4,42.61 8.2,43.41 25.3,43.41 27.1,45.21 v27.1,58.61 | v34.1,58.61 44.5,58.61 45.1,59.21 45.1,63.41 IC5.8 | C14.2 19.83,18.97 | C13.2 20,22.17
  Top 0.61: 20.1,14.93 U1.13
  Bottom 0.406: v13,31.11 v9,31.11 | v27.1,58.61 v34.1,58.61
IR_TRANSMITTER
  Top 0.305: IC5.6 40.07,64.74 38.8,66.01 24.19,66.01 20.38,69.82 7.04,69.82 1.33,64.1 1.33,9.49 1.77,9.05 R18.2
LIGHT_INT  (via drill 0.6)
  Top 0.254: v48.32,53.94 48.32,51.19 49,50.51 R5.1
  Top 0.305: IC2.5 42.12,11.84 41.34,11.06 41.34,6.32 42.61,5.05 68,5.05 68.64,5.68 71.18,5.68 71.81,6.32 71.81,51.81 71.18,52.44 71.1,52.51 62.2,52.51 60.77,53.94 v52.13,53.94 | IC5.23 R5.1
  Bottom 0.305: v52.13,53.94 v48.32,53.94
MIC_AMP_IN
  Top 0.305: R6.2 5.88,61.83 U2.1 6.15,62.57 6.41,62.83 6.41,66.01 8.95,68.55 19.75,68.55 22.92,65.37 36.89,65.37 37.52,64.74 IC5.5
N$1
  Top 0.305: R2.1 11.5,66.64 10.22,66.64 8.95,65.37 8.95,60.93 8.31,60.29 U2.2 3.87,60.29 3.6,60.03 R6.1
N$2
  Top 0.61: D1.A R15.1
N$4
  Top 0.406: R2.2 C10.2
N$5
  Top 0.305: U2.7 U2.6 U2.3
N$6
  Top 0.305: D2.A 51.98,68.55 R1.1
  Top 0.406: 51.9,68.64 R1.1
N$7
  Top 0.305: C10.1 15.94,63.29 IC4.1
N$8
  Top 0.61: R17.1 D3.A
N$9
  Top 0.305: R12.1 R7.2 | R7.2 C9.2 | U2.5 11.75,55.1 R7.2
N$11
  Top 0.61: Q1.3 6.9,9.84 D3.C D1.C
N$12
  Top 0.305: R12.2 R20.1
N$13
  Top 0.406: R25.2 IC5.7
N$14
  Top 0.406: C12.2 21.3,15.79 U1.12
N$15
  Top 0.406: U1.10 23.87,18.51 C11.2
N$16
  Top 0.305: C11.1 R14.1
N$17
  Top 0.61: D7.A 10.53,41.34 10.1,40.91 10.1,39.15 CR2.P$1 10.12,36.91 JP1.2
N$18
  Top 0.305: R18.1 5.93,6.2 Q1.1 5.96,6.21 R19.1
N$19  (via drill 0.6)
  Top 0.61: v35.34,39.4 F1.2
  Bottom 0.61: J1.2 33.67,37.73 v35.34,39.4
N$20
  Top 0.305: R16.1 38.11,36.54 D4.A
N$25
  Top 0.305: U3.8 60.52,30.58 59.75,31.08 59.75,31.88 R8.2
NTC_SENSE
  Top 0.305: IC3.4 IC3.5 65.9,10.71 R28.1
RX
  Top 0.305: JP3.1 63.41,67.13 62.93,66.64 61.02,66.64 60.38,66.01 IC5.14
SCL  (via drill 0.6)
  Top 0.305: IC3.10 57.62,12.9 57.21,12.9 | 57.21,12.9 53.72,12.9 IC1.4 53.71,12.91 53.71,12.19 53.36,11.84 IC2.2 | U3.4 65.97,28.41 66.1,28.54 66.1,34.8 JP6.1 | IC5.18 62.93,40.61 66.1,37.43 66.1,35.15 JP6.1 | v57.65,18.35 57.78,18.38 67.37,18.38 68,19.02 68,24.73 | U1.3 21.33,4.73 22.29,3.78 31.81,3.78 32.45,4.41 32.45,20.29 | 32.45,20.29 32.45,24.1 33.08,24.73 52.13,24.73 52.77,24.1 65.47,24.1 66.1,24.73 68,24.73 | 66.01,34.89 JP6.1 | 68,24.73 68,34.21 67.37,34.84 66.06,34.84 JP6.1 | 57.21,12.9 57.62,13.31 v57.62,15.3 v57.62,15.31 | R4.1 32.32,20.41 32.45,20.29
  Bottom 0.305: v57.62,15.31 57.62,18.22 v57.65,18.35
SDA  (via drill 0.6)
  Top 0.254: 63.87,35.04 63.87,37.84 61.7,40.01 61.7,44.71 62,45.01 65.2,45.01 65.6,44.61 65.6,43.28 IC5.17
  Top 0.305: IC1.3 52.88,14.5 | IC2.6 43.17,11.19 v42.7,10.72 | IC3.9 62.01,15.86 62.01,16.48 | v52.88,14.53 55.08,14.53 56.98,16.43 61.96,16.43 62.01,16.48 | U3.6 61.52,30.95 62.29,31.72 62.93,31.72 63.93,32.72 JP6.2 63.87,35.04 | IC5.17 69.27,39.34 v69.27,23.46 69.27,18.38 68.64,17.75 62.59,17.75 62.01,17.16 62.01,16.48 | U1.2 20.06,4.06 21.02,3.11 32.45,3.11 33.08,3.74 33.08,22.19 | 33.08,22.19 33.08,23.46 33.71,24.1 51.5,24.1 52.13,23.46 v66.73,23.46 | R3.1 33.24,22.35 33.08,22.19
  Top 0.406: 52.88,14.5 v52.88,14.53
  Bottom 0.305: v52.88,14.53 43.68,14.52 43.22,14.52 42.7,14.01 v42.7,10.72 | v66.73,23.46 v69.27,23.46
SPI_MISO
  Top 0.305: J2.4 58.3,59.41 57.8,59.91 57.8,63.42 IC5.13
SPI_MOSI
  Top 0.305: J2.3 56.1,58.41 55.3,59.21 IC5.12
  Top 0.406: R1.2 54.68,68.54 55.3,67.91 IC5.12
SPI_SCK
  Top 0.305: J2.2 53.3,57.41 52.8,57.91 52.8,63.43 IC5.11
TX
  Top 0.305: JP3.2 61.41,68.94 59.12,66.64 59.12,62.2 59.75,61.56 62.29,61.56 62.93,62.2 IC5.15
USB
  Top 0.61: F1.1 41.69,39.4 42.6,40.31 IC5.26
VBAT  (via drill 0.6)
  Top 0.406: IC5.28 37.52,46.03 38.3,46.81 J3.3
  Top 0.61: v30.74,43.15 28,43.15 23.69,39.14 23.69,39.1 23.6,39.01 14.5,39.01 CR123A.P$1 | CR123A.P$1 14.4,41.01 14.1,41.31 13.13,41.31 D7.C | JP1.1 13.54,36.05 14.4,36.91 CR123A.P$1
  Bottom 0.61: v30.74,43.15 IC5.28
VCCA  (via drill 0.6)
  Top 0.305: IC4.4 17.42,62.2 18.48,62.2 C8.2 | U2.8 11.75,63.36 C17.2 | R20.2 15.35,49.23 16.57,50.45 16.57,57.12 | R25.1 40.53,60.91 40.37,61.04
  Top 0.406: U2.8 13.39,61.56 14.03,60.93 14.03,57.75 14.66,57.12 16.57,57.12 19.75,57.12 20.68,57.95 20.68,61.08 | 20.68,61.08 19.76,62.2 18.48,62.2 | 20.68,61.08 25.64,61.08 v25.78,61.04 | v33.4,61.04 40.37,61.04 | R24.2 25.82,61.01
  Top 0.61: 25.82,61.01 v25.78,61.04
  Bottom 0.406: v25.78,61.04 v33.4,61.04

### Text on the board
Dimension: CUTOUT | CUTOUT | CUTOUT | CUTOUT
tNames: GND | 3v3 | A4 | A5 | GND | 3v3 | TX | RX | Sound / Level | Serial | Gain | 3v3 | ThingySticks.com | SPI | Environment Monitor | GND | Low Power / Option | VBat | GND | EN | GND | 3v3 | SDA | SCL | I2C | Connect for / rechargable / CR2 battery. | Light | IR Blaster | T/RH / Pres' / VOC | VOC / eCO2 | Thermal / Camera | S.Harrison | 16 March 2019 | V6.1
bNames: GND | 3v3 | A4 | A5 | GND | 3v3 | TX | RX | Serial | + | 5V ONLY | +VE | I2C | GND | GND | 3v3 | SDA | SCL | ThingySticks.com | RCR123 | CR2 | Environment Monitor | V6.1 | Batt -VE
tDocu: Xenon On / Reverse | Battery On / Reverse | . mark / on Anode